# Altium schematic sheet schematic.SchDoc
size A4
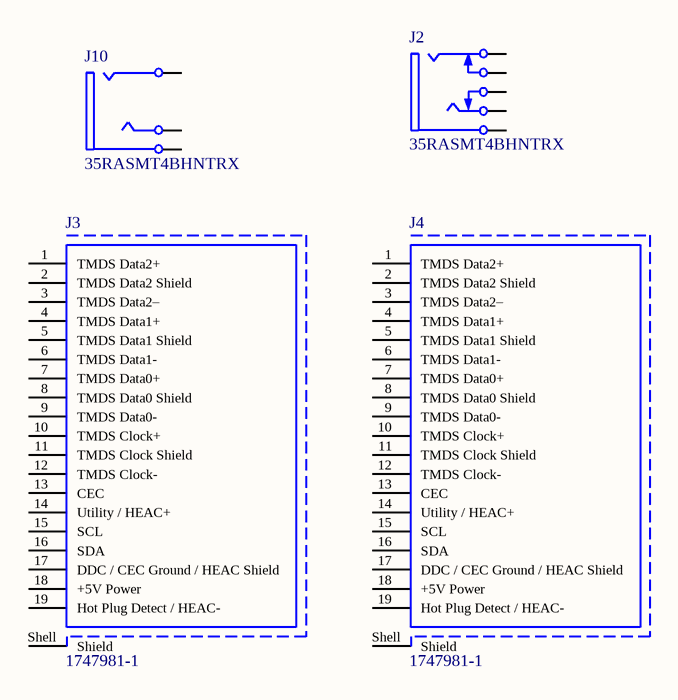
[diagram p0: schematic.SchDoc]

## Parts
J2  35RASMT4BHNTRX  [AUDIO_FEMALE]
J3  1747981-1  [HDMI_FULL_FEMALE]
J4  1747981-1  [HDMI_FULL_FEMALE]
J10  35RASMT4BHNTRX  [AUDIO_MALE]

## Nets

Not connected (* = marked no-connect by the designer): J2 1 2 3 4 5; J3 1(TMDS_Data2+) 2(TMDS_Data2_Shield) 3(TMDS_Data2–) 4(TMDS_Data1+) 5(TMDS_Data1_Shield) 6(TMDS_Data1-) 7(TMDS_Data0+) 8(TMDS_Data0_Shield) 9(TMDS_Data0-) 10(TMDS_Clock+) 11(TMDS_Clock_Shield) 12(TMDS_Clock-) 13(CEC) 14(Utility_/_HEAC+) 15(SCL) 16(SDA) 17(DDC_/_CEC_Ground_/_HEAC_Shield) 18(+5V_Power) 19(Hot_Plug_Detect_/_HEAC-) Shell(Shield); J4 1(TMDS_Data2+) 2(TMDS_Data2_Shield) 3(TMDS_Data2–) 4(TMDS_Data1+) 5(TMDS_Data1_Shield) 6(TMDS_Data1-) 7(TMDS_Data0+) 8(TMDS_Data0_Shield) 9(TMDS_Data0-) 10(TMDS_Clock+) 11(TMDS_Clock_Shield) 12(TMDS_Clock-) 13(CEC) 14(Utility_/_HEAC+) 15(SCL) 16(SDA) 17(DDC_/_CEC_Ground_/_HEAC_Shield) 18(+5V_Power) 19(Hot_Plug_Detect_/_HEAC-) Shell(Shield); J10 1 2 3

## Library data of the parts
J2 = AUDIO_FEMALE: Female 3.5 mm Phone Jack, 5 Position, Height 5 mm, RoHS, Tape and Reel; Current Rating: 50 mA; Voltage Rating (DC): 12 V; ComponentLink1URL: http://www.switchcraft.com/; ComponentLink2Description: Datasheet; ComponentLink2URL: http://www.switchcraft.com/Drawings/35rasmt4bhntrx_cd.pdf; PackageDescription: Female 3.5 mm Phone Jack, 5 Position, Height 5 mm; PackageReference: 35RASMT4BHNTRX; Mount: Through Hole; DatasheetVersion: Rev. C, 07/2014; Contact Material: Silver; ComponentLink1Description: Manufacturer URL; Packaging: Tape and Reel; RoHSCompliant: true; Contact Plating: Silver; Package Quantity: 3000
J3 J4 = HDMI_FULL_FEMALE: HDMI Receptacle, Pitch 0.5 mm, 19 Position, Height 6.38 mm, RoHS, Tape and Reel; Power Rating: 100 mW; Tolerance: 1%; Resistance: 3.6 kohm; Voltage Rating: 50 V; Packaging: Tape and Reel; Max Operating Temperature: 155degC; RoHSCompliant: True; Case/Package: 0603; Mount: Surface Mount; ComponentLink2URL: http://www.te.com/commerce/DocumentDelivery/DDEController?Action=showdoc&DocId=Customer+Drawing%7F1747981%7FF5%7Fpdf%7FEnglish%7FENG_CD_1747981_F5.pdf%7F1747981-1; Length: 1.6 mm; ComponentLink2Description: Datasheet; ComponentLink1Description: Manufacturer URL; PackageReference: 1747981-1; Package Quantity: 5000; Min Operating Temperature: -55degC; ComponentLink1URL: http://www.te.com/; REACH SVHC: Unknown; Case Code (Imperial): 0603; Height: 0.45 mm; Width: 0.8 mm; DatasheetVersion: Rev. F5, 12/2015; PackageDescription: HDMI Receptacle, Pitch 0.5 mm, 19 Position, Height 6.38 mm; Case Code (Metric): 1608
J10 = AUDIO_MALE: Female 3.5 mm Phone Jack, 5 Position, Height 5 mm, RoHS, Tape and Reel; Current Rating: 50 mA; Voltage Rating (DC): 12 V; ComponentLink1URL: http://www.switchcraft.com/; ComponentLink2Description: Datasheet; ComponentLink2URL: http://www.switchcraft.com/Drawings/35rasmt4bhntrx_cd.pdf; PackageDescription: Female 3.5 mm Phone Jack, 5 Position, Height 5 mm; PackageReference: 35RASMT4BHNTRX; Mount: Through Hole; DatasheetVersion: Rev. C, 07/2014; Contact Material: Silver; ComponentLink1Description: Manufacturer URL; Packaging: Tape and Reel; RoHSCompliant: true; Contact Plating: Silver; Package Quantity: 3000